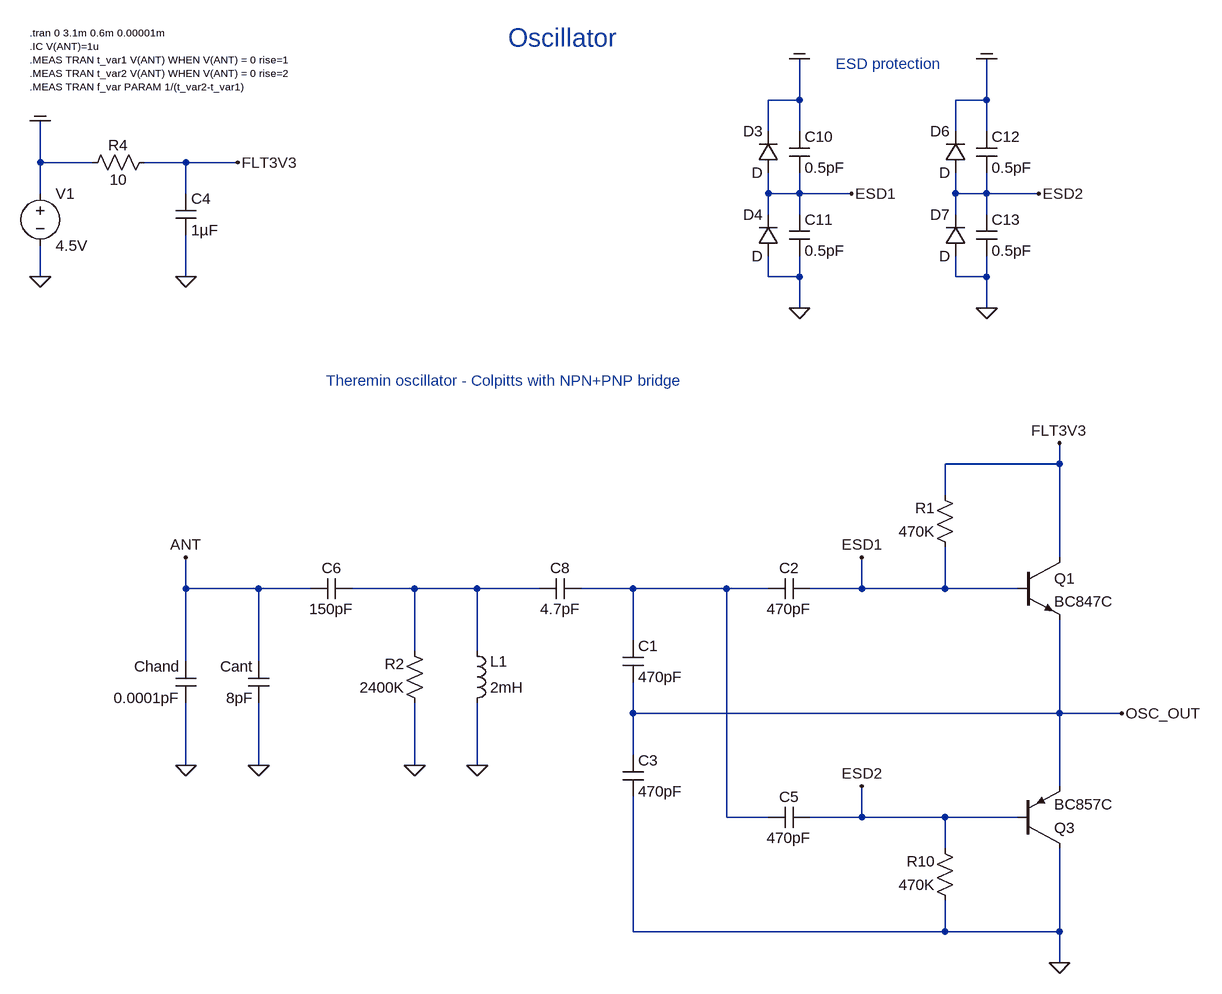
[diagram p0: schematic 2020_npn_pnp_advanced_osc_v2.asc]
2020_npn_pnp_advanced_osc_v2.asc, the LTspice schematic file:
Version 4
SHEET 1 2908 2724
WIRE 176 -96 176 -160
WIRE 176 -96 128 -96
WIRE 464 -96 464 -160
WIRE 464 -96 416 -96
WIRE 128 -48 128 -96
WIRE 176 -48 176 -96
WIRE 416 -48 416 -96
WIRE 464 -48 464 -96
WIRE -992 0 -992 -64
WIRE -912 0 -992 0
WIRE -768 0 -832 0
WIRE -688 0 -768 0
WIRE -992 48 -992 0
WIRE -768 48 -768 0
WIRE 128 48 128 16
WIRE 176 48 176 16
WIRE 176 48 128 48
WIRE 256 48 176 48
WIRE 416 48 416 16
WIRE 464 48 464 16
WIRE 464 48 416 48
WIRE 544 48 464 48
WIRE 128 80 128 48
WIRE 176 80 176 48
WIRE 416 80 416 48
WIRE 464 80 464 48
WIRE -992 176 -992 128
WIRE -768 176 -768 112
WIRE 128 176 128 144
WIRE 176 176 176 144
WIRE 176 176 128 176
WIRE 416 176 416 144
WIRE 464 176 464 144
WIRE 464 176 416 176
WIRE 176 224 176 176
WIRE 464 224 464 176
WIRE 576 464 576 432
WIRE 576 464 400 464
WIRE 400 512 400 464
WIRE 576 608 576 464
WIRE -768 656 -768 608
WIRE -656 656 -768 656
WIRE -576 656 -656 656
WIRE -416 656 -512 656
WIRE -320 656 -416 656
WIRE -224 656 -320 656
WIRE -80 656 -160 656
WIRE 64 656 -80 656
WIRE 128 656 64 656
WIRE 272 656 272 608
WIRE 272 656 192 656
WIRE 400 656 400 592
WIRE 400 656 272 656
WIRE 512 656 400 656
WIRE -80 736 -80 656
WIRE -416 752 -416 656
WIRE -320 752 -320 656
WIRE -768 768 -768 656
WIRE -656 768 -656 656
WIRE -80 848 -80 800
WIRE 576 848 576 704
WIRE 576 848 -80 848
WIRE 672 848 576 848
WIRE -80 912 -80 848
WIRE -768 928 -768 832
WIRE -656 928 -656 832
WIRE -416 928 -416 832
WIRE -320 928 -320 832
WIRE 576 960 576 848
WIRE 64 1008 64 656
WIRE 128 1008 64 1008
WIRE 272 1008 272 960
WIRE 272 1008 192 1008
WIRE 400 1008 272 1008
WIRE 512 1008 400 1008
WIRE 400 1056 400 1008
WIRE -80 1184 -80 976
WIRE 400 1184 400 1136
WIRE 400 1184 -80 1184
WIRE 576 1184 576 1056
WIRE 576 1184 400 1184
WIRE 576 1232 576 1184
FLAG -992 176 0
FLAG -768 928 0
FLAG -768 608 ANT
FLAG -992 -64 COM
FLAG 176 224 0
FLAG 176 -160 COM
FLAG 256 48 ESD1
FLAG 464 224 0
FLAG 464 -160 COM
FLAG 544 48 ESD2
FLAG -656 928 0
FLAG 272 608 ESD1
FLAG -768 176 0
FLAG -416 928 0
FLAG -320 928 0
FLAG -688 0 FLT3V3
FLAG 576 432 FLT3V3
FLAG 672 848 OSC_OUT
FLAG 576 1232 0
FLAG 272 960 ESD2
SYMBOL voltage -992 32 R0
WINDOW 123 0 0 Left 2
WINDOW 39 0 0 Left 2
SYMATTR InstName V1
SYMATTR Value 4.5V
SYMBOL ind -336 848 M180
WINDOW 0 36 80 Left 2
WINDOW 3 36 40 Left 2
SYMATTR InstName L1
SYMATTR Value 2mH
SYMATTR SpiceLine Ipk=0.1 Rser=82 Rpar=20Meg Cpar=1.286pF
SYMBOL cap -752 768 M0
SYMATTR InstName Chand
SYMATTR Value 0.0001pF
SYMBOL diode 144 16 R180
WINDOW 0 24 64 Left 2
WINDOW 3 24 0 Left 2
SYMATTR InstName D3
SYMBOL diode 144 144 R180
WINDOW 0 24 64 Left 2
WINDOW 3 24 0 Left 2
SYMATTR InstName D4
SYMBOL cap 160 -48 R0
SYMATTR InstName C10
SYMATTR Value 0.5pF
SYMBOL cap 160 80 R0
SYMATTR InstName C11
SYMATTR Value 0.5pF
SYMBOL diode 432 16 R180
WINDOW 0 24 64 Left 2
WINDOW 3 24 0 Left 2
SYMATTR InstName D6
SYMBOL diode 432 144 R180
WINDOW 0 24 64 Left 2
WINDOW 3 24 0 Left 2
SYMATTR InstName D7
SYMBOL cap 448 -48 R0
SYMATTR InstName C12
SYMATTR Value 0.5pF
SYMBOL cap 448 80 R0
SYMATTR InstName C13
SYMATTR Value 0.5pF
SYMBOL cap -640 768 M0
SYMATTR InstName Cant
SYMATTR Value 8pF
SYMBOL res -816 -16 R90
WINDOW 0 5 56 VBottom 2
WINDOW 3 27 56 VTop 2
SYMATTR InstName R4
SYMATTR Value 10
SYMBOL cap -784 48 R0
SYMATTR InstName C4
SYMATTR Value 1µF
SYMBOL res 416 608 R180
WINDOW 0 31 76 Left 2
WINDOW 3 31 40 Left 2
SYMATTR InstName R1
SYMATTR Value 470K
SYMBOL res -400 848 R180
WINDOW 0 31 76 Left 2
WINDOW 3 31 40 Left 2
SYMATTR InstName R2
SYMATTR Value 2400K
SYMBOL cap -96 736 R0
SYMATTR InstName C1
SYMATTR Value 470pF
SYMBOL cap -96 912 R0
SYMATTR InstName C3
SYMATTR Value 470pF
SYMBOL npn 512 608 R0
SYMATTR InstName Q1
SYMATTR Value BC847C
SYMBOL cap -160 640 R90
WINDOW 0 0 32 VBottom 2
WINDOW 3 32 32 VTop 2
SYMATTR InstName C8
SYMATTR Value 4.7pF
SYMBOL pnp 512 1056 M180
SYMATTR InstName Q3
SYMATTR Value BC857C
SYMBOL res 416 1152 R180
WINDOW 0 31 76 Left 2
WINDOW 3 31 40 Left 2
SYMATTR InstName R10
SYMATTR Value 470K
SYMBOL cap 192 640 R90
WINDOW 0 0 32 VBottom 2
WINDOW 3 32 32 VTop 2
SYMATTR InstName C2
SYMATTR Value 470pF
SYMBOL cap 192 992 R90
WINDOW 0 0 32 VBottom 2
WINDOW 3 32 32 VTop 2
SYMATTR InstName C5
SYMATTR Value 470pF
SYMBOL cap -512 640 R90
WINDOW 0 0 32 VBottom 2
WINDOW 3 32 32 VTop 2
SYMATTR InstName C6
SYMATTR Value 150pF
TEXT -1008 -200 Left 1 !.tran 0 3.1m 0.6m 0.00001m\n.IC V(ANT)=1u\n.MEAS TRAN t_var1 V(ANT) WHEN V(ANT) = 0 rise=1\n.MEAS TRAN t_var2 V(ANT) WHEN V(ANT) = 0 rise=2\n.MEAS TRAN f_var PARAM 1/(t_var2-t_var1)
TEXT 232 -152 Left 2 ;ESD protection
TEXT -272 -192 Left 4 ;Oscillator
TEXT -552 336 Left 2 ;Theremin oscillator - Colpitts with NPN+PNP bridge

The netlist it stands for:
* 2020_npn_pnp_advanced_osc_v2.asc
V1 COM 0 4.5V
L1 0 N001 2mH Ipk=0.1 Rser=82 Rpar=20Meg Cpar=1.286pF
Chand ANT 0 0.0001pF
D3 ESD1 COM D
D4 0 ESD1 D
C10 COM ESD1 0.5pF
C11 ESD1 0 0.5pF
D6 ESD2 COM D
D7 0 ESD2 D
C12 COM ESD2 0.5pF
C13 ESD2 0 0.5pF
Cant ANT 0 8pF
R4 FLT3V3 COM 10
C4 FLT3V3 0 1µF
R1 ESD1 FLT3V3 470K
R2 0 N001 2400K
C1 N002 OSC_OUT 470pF
C3 OSC_OUT 0 470pF
Q1 FLT3V3 ESD1 OSC_OUT 0 BC847C
C8 N002 N001 4.7pF
Q3 0 ESD2 OSC_OUT 0 BC857C
R10 0 ESD2 470K
C2 ESD1 N002 470pF
C5 ESD2 N002 470pF
C6 N001 ANT 150pF
.model D D
.lib standard.dio
.model NPN NPN
.model PNP PNP
.lib standard.bjt
.tran 0 3.1m 0.6m 0.00001m
.IC V(ANT)=1u
.MEAS TRAN t_var1 V(ANT) WHEN V(ANT) = 0 rise=1
.MEAS TRAN t_var2 V(ANT) WHEN V(ANT) = 0 rise=2
.MEAS TRAN f_var PARAM 1/(t_var2-t_var1)
* ESD protection
* Oscillator
* Theremin oscillator - Colpitts with NPN+PNP bridge
.backanno
.end